# Altium schematic sheet Nguon.SchDoc
size A
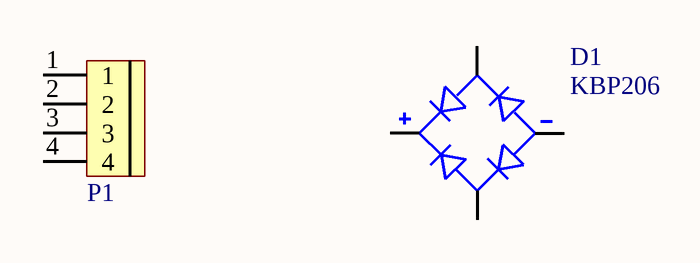
[diagram p0: Nguon.SchDoc]

## Parts
D1  KBP206  [SIP380W81P386L1470H1270Q4]
P1  CON 4 EDG5.08  [CON 4 4EDG5.08]  (value not drawn)

## Nets

Not connected (* = marked no-connect by the designer): D1 1(POS) 2(AC1) 3(AC2) 4(NEG); P1 1 2 3 4

## Library data of the parts
D1 = KBP206: ÛŒÚ©Ø³Ùˆ Ú©Ù†Ù†Ø¯Ù‡ Ù¾Ù„ ØªÚ© ÙØ§Ø² Ø§Ø³ØªØ§Ù†Ø¯Ø§Ø±Ø¯ 600 ÙˆÙ„Øª Ø§Ø² Ø·Ø±ÛŒÙ‚ Ø³ÙˆØ±Ø§Ø® KBP; MF: GeneSiC Semiconductor; SnapEDA_Link: https://www.snapeda.com/parts/KBP206/GeneSiC+Semiconductor/view-part/?ref=snap; Package: SIP-4 GeneSiC Semiconductor; Value: *; MP: KBP206; Check_prices: https://www.snapeda.com/parts/KBP206/GeneSiC+Semiconductor/view-part/?ref=eda
P1 = CON 4 EDG5.08: Cắm; Ten_Linh_Kien: CON 4 2EDG5.08-4P 5.08MM ( Xanh Cong); Ma_Hang: MH000979; Don_Vi: Con; Ghi_Chu: *; Kieu_Chan: *; Chung_Loai: Cắm